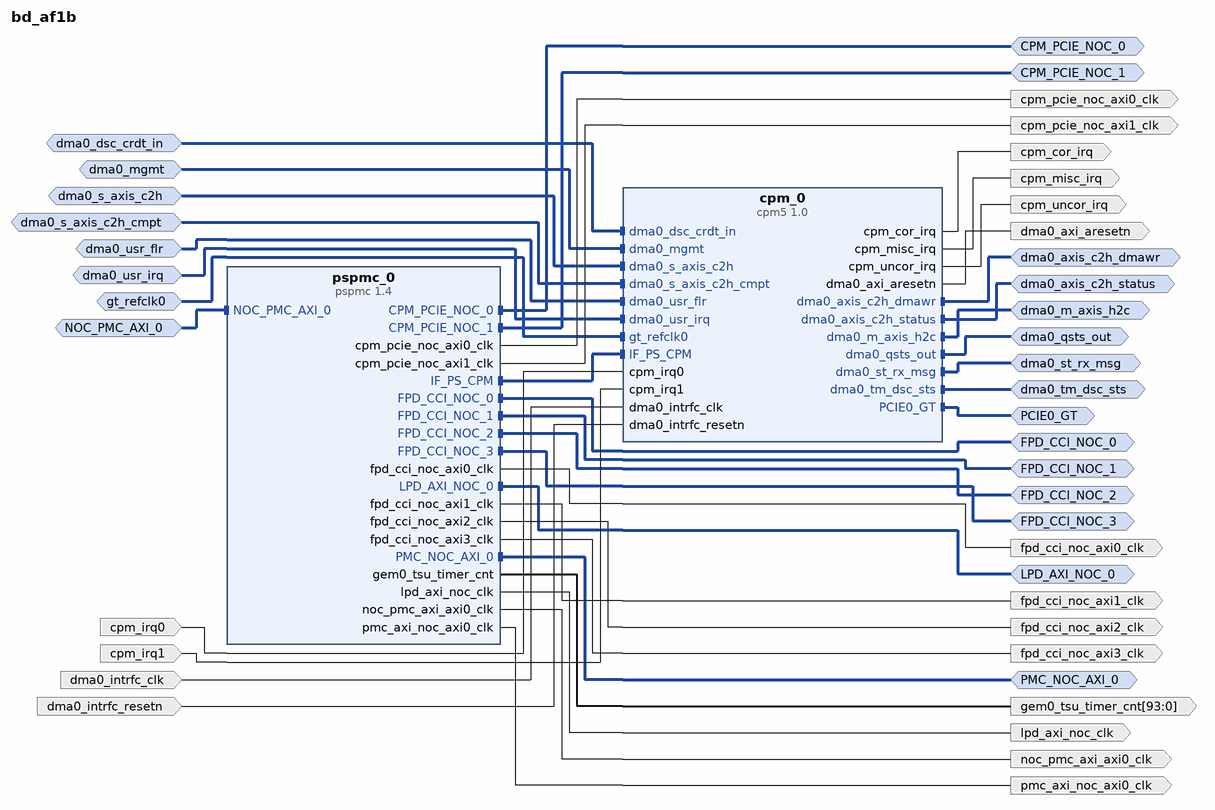
[diagram p0: block diagram of the top level]
# Vivado block design bd_af1b, xcvp1802-lsvc4072-2MP-e-S, Vivado 2025.2
create_bd_design bd_af1b

create_bd_intf_port -mode Master -vlnv xilinx.com:interface:aximm_rtl:1.0 FPD_CCI_NOC_0
set_property -dict {CONFIG.FREQ_HZ 824999207 CONFIG.INDEX 0} [get_bd_intf_ports FPD_CCI_NOC_0]
create_bd_intf_port -mode Master -vlnv xilinx.com:interface:aximm_rtl:1.0 FPD_CCI_NOC_1
set_property -dict {CONFIG.FREQ_HZ 824999207 CONFIG.INDEX 1} [get_bd_intf_ports FPD_CCI_NOC_1]
create_bd_intf_port -mode Master -vlnv xilinx.com:interface:aximm_rtl:1.0 FPD_CCI_NOC_2
set_property -dict {CONFIG.FREQ_HZ 824999207 CONFIG.INDEX 2} [get_bd_intf_ports FPD_CCI_NOC_2]
create_bd_intf_port -mode Master -vlnv xilinx.com:interface:aximm_rtl:1.0 FPD_CCI_NOC_3
set_property -dict {CONFIG.FREQ_HZ 824999207 CONFIG.INDEX 3} [get_bd_intf_ports FPD_CCI_NOC_3]
create_bd_intf_port -mode Master -vlnv xilinx.com:interface:aximm_rtl:1.0 LPD_AXI_NOC_0
set_property -dict {CONFIG.FREQ_HZ 599999451 CONFIG.INDEX 0} [get_bd_intf_ports LPD_AXI_NOC_0]
create_bd_intf_port -mode Master -vlnv xilinx.com:interface:aximm_rtl:1.0 PMC_NOC_AXI_0
set_property -dict {CONFIG.FREQ_HZ 400000000 CONFIG.INDEX 0 CONFIG.SLR_INDEX 0} [get_bd_intf_ports PMC_NOC_AXI_0]
create_bd_intf_port -mode Slave -vlnv xilinx.com:interface:aximm_rtl:1.0 NOC_PMC_AXI_0
set_property -dict {CONFIG.FREQ_HZ 400000000 CONFIG.INDEX 0 CONFIG.SLR_INDEX 0} [get_bd_intf_ports NOC_PMC_AXI_0]
create_bd_intf_port -mode Master -vlnv xilinx.com:interface:aximm_rtl:1.0 CPM_PCIE_NOC_0
set_property -dict {CONFIG.FREQ_HZ 1000000000 CONFIG.INDEX 0} [get_bd_intf_ports CPM_PCIE_NOC_0]
create_bd_intf_port -mode Master -vlnv xilinx.com:interface:aximm_rtl:1.0 CPM_PCIE_NOC_1
set_property -dict {CONFIG.FREQ_HZ 1000000000 CONFIG.INDEX 1} [get_bd_intf_ports CPM_PCIE_NOC_1]
create_bd_intf_port -mode Slave -vlnv xilinx.com:interface:cpm_dma_mgmt_rtl:1.0 dma0_mgmt
create_bd_intf_port -mode Master -vlnv xilinx.com:interface:axis_rtl:1.0 dma0_st_rx_msg
create_bd_intf_port -mode Master -vlnv xilinx.com:display_eqdma:axis_c2h_dmawr_rtl:1.0 dma0_axis_c2h_dmawr
create_bd_intf_port -mode Slave -vlnv xilinx.com:display_eqdma:s_axis_c2h_rtl:1.0 dma0_s_axis_c2h
create_bd_intf_port -mode Slave -vlnv xilinx.com:display_eqdma:s_axis_c2h_cmpt_rtl:1.0 dma0_s_axis_c2h_cmpt
create_bd_intf_port -mode Master -vlnv xilinx.com:display_eqdma:m_axis_h2c_rtl:1.0 dma0_m_axis_h2c
create_bd_intf_port -mode Master -vlnv xilinx.com:interface:qdma_c2h_status_rtl:1.0 dma0_axis_c2h_status
create_bd_intf_port -mode Master -vlnv xilinx.com:interface:eqdma_qsts_rtl:1.0 dma0_qsts_out
create_bd_intf_port -mode Slave -vlnv xilinx.com:interface:qdma_dsc_crdt_in_rtl:1.0 dma0_dsc_crdt_in
create_bd_intf_port -mode Slave -vlnv xilinx.com:interface:qdma_usr_irq_rtl:1.0 dma0_usr_irq
create_bd_intf_port -mode Master -vlnv xilinx.com:interface:qdma_tm_dsc_sts_rtl:1.0 dma0_tm_dsc_sts
create_bd_intf_port -mode Slave -vlnv xilinx.com:interface:qdma_usr_flr_rtl:1.0 dma0_usr_flr
create_bd_intf_port -mode Master -vlnv xilinx.com:interface:gt_rtl:1.0 PCIE0_GT
create_bd_intf_port -mode Slave -vlnv xilinx.com:interface:diff_clock_rtl:1.0 gt_refclk0
set_property -dict {CONFIG.FREQ_HZ 100000000} [get_bd_intf_ports gt_refclk0]
create_bd_port -dir O -type clk fpd_cci_noc_axi0_clk
set_property -dict {CONFIG.FREQ_HZ 824999207} [get_bd_ports fpd_cci_noc_axi0_clk]
create_bd_port -dir O -type clk fpd_cci_noc_axi1_clk
set_property -dict {CONFIG.FREQ_HZ 824999207} [get_bd_ports fpd_cci_noc_axi1_clk]
create_bd_port -dir O -type clk fpd_cci_noc_axi2_clk
set_property -dict {CONFIG.FREQ_HZ 824999207} [get_bd_ports fpd_cci_noc_axi2_clk]
create_bd_port -dir O -type clk fpd_cci_noc_axi3_clk
set_property -dict {CONFIG.FREQ_HZ 824999207} [get_bd_ports fpd_cci_noc_axi3_clk]
create_bd_port -dir O -type clk lpd_axi_noc_clk
set_property -dict {CONFIG.FREQ_HZ 599999451} [get_bd_ports lpd_axi_noc_clk]
create_bd_port -dir O -type clk pmc_axi_noc_axi0_clk
set_property -dict {CONFIG.FREQ_HZ 400000000} [get_bd_ports pmc_axi_noc_axi0_clk]
create_bd_port -dir O -type clk noc_pmc_axi_axi0_clk
set_property -dict {CONFIG.FREQ_HZ 400000000} [get_bd_ports noc_pmc_axi_axi0_clk]
create_bd_port -dir O -from 93 -to 0 gem0_tsu_timer_cnt
create_bd_port -dir O -type clk cpm_pcie_noc_axi0_clk
set_property -dict {CONFIG.FREQ_HZ 1000000000} [get_bd_ports cpm_pcie_noc_axi0_clk]
create_bd_port -dir O -type clk cpm_pcie_noc_axi1_clk
set_property -dict {CONFIG.FREQ_HZ 1000000000} [get_bd_ports cpm_pcie_noc_axi1_clk]
create_bd_port -dir I -type clk dma0_intrfc_clk
set_property -dict {CONFIG.ASSOCIATED_RESET dma0_axi_aresetn} [get_bd_ports dma0_intrfc_clk]
create_bd_port -dir O -type intr cpm_misc_irq
create_bd_port -dir O -type intr cpm_cor_irq
create_bd_port -dir O -type intr cpm_uncor_irq
create_bd_port -dir I -type intr cpm_irq0
create_bd_port -dir I -type intr cpm_irq1
create_bd_port -dir O -type rst dma0_axi_aresetn
set_property -dict {CONFIG.POLARITY ACTIVE_LOW} [get_bd_ports dma0_axi_aresetn]
create_bd_port -dir I -type rst dma0_intrfc_resetn
set_property -dict {CONFIG.POLARITY ACTIVE_LOW} [get_bd_ports dma0_intrfc_resetn]

create_bd_cell -type ip -vlnv xilinx.com:ip:pspmc:1.4 pspmc_0
